# EAGLE design TouchProof_Breakout (EAGLE 9.3.2)
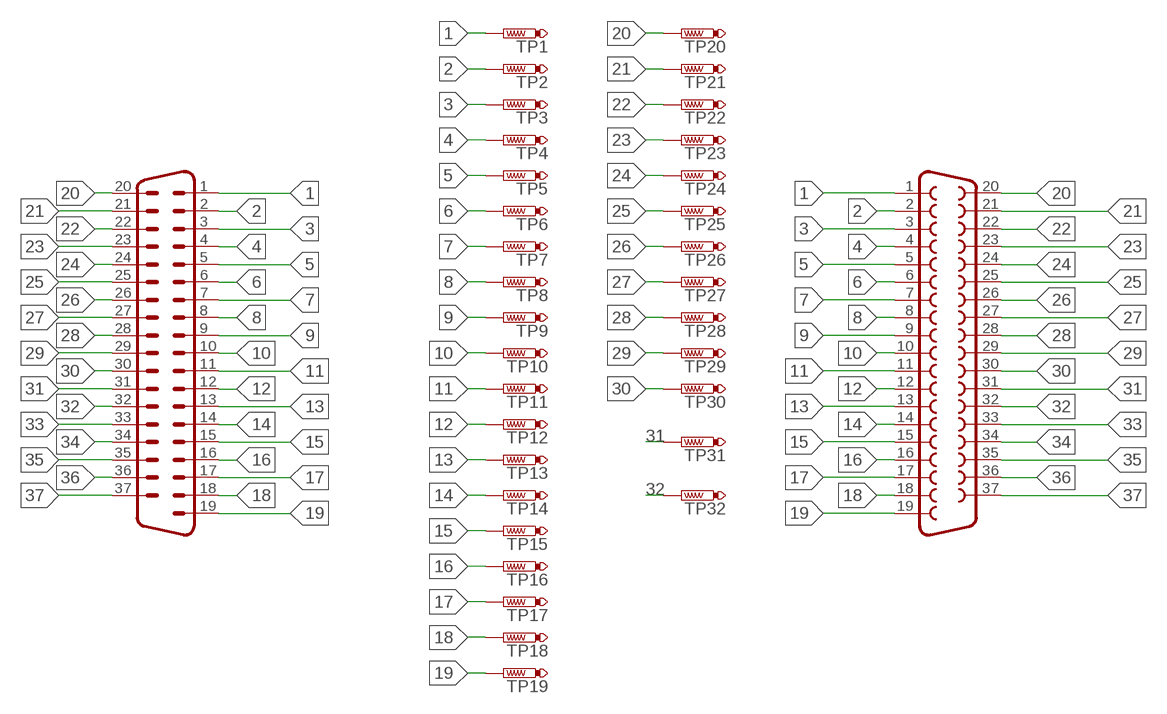
[diagram p0: schematic, sheet 1]

## Parts
TP1  TOUCHPROOF  [TOUCHPROOF_PIN]
TP2  TOUCHPROOF  [TOUCHPROOF_PIN]
TP3  TOUCHPROOF  [TOUCHPROOF_PIN]
TP4  TOUCHPROOF  [TOUCHPROOF_PIN]
TP5  TOUCHPROOF  [TOUCHPROOF_PIN]
TP6  TOUCHPROOF  [TOUCHPROOF_PIN]
TP7  TOUCHPROOF  [TOUCHPROOF_PIN]
TP8  TOUCHPROOF  [TOUCHPROOF_PIN]
TP9  TOUCHPROOF  [TOUCHPROOF_PIN]
TP10  TOUCHPROOF  [TOUCHPROOF_PIN]
TP11  TOUCHPROOF  [TOUCHPROOF_PIN]
TP12  TOUCHPROOF  [TOUCHPROOF_PIN]
TP13  TOUCHPROOF  [TOUCHPROOF_PIN]
TP14  TOUCHPROOF  [TOUCHPROOF_PIN]
TP15  TOUCHPROOF  [TOUCHPROOF_PIN]
TP16  TOUCHPROOF  [TOUCHPROOF_PIN]
TP17  TOUCHPROOF  [TOUCHPROOF_PIN]
TP18  TOUCHPROOF  [TOUCHPROOF_PIN]
TP19  TOUCHPROOF  [TOUCHPROOF_PIN]
TP20  TOUCHPROOF  [TOUCHPROOF_PIN]
TP21  TOUCHPROOF  [TOUCHPROOF_PIN]
TP22  TOUCHPROOF  [TOUCHPROOF_PIN]
TP23  TOUCHPROOF  [TOUCHPROOF_PIN]
TP24  TOUCHPROOF  [TOUCHPROOF_PIN]
TP25  TOUCHPROOF  [TOUCHPROOF_PIN]
TP26  TOUCHPROOF  [TOUCHPROOF_PIN]
TP27  TOUCHPROOF  [TOUCHPROOF_PIN]
TP28  TOUCHPROOF  [TOUCHPROOF_PIN]
TP29  TOUCHPROOF  [TOUCHPROOF_PIN]
TP30  TOUCHPROOF  [TOUCHPROOF_PIN]
TP31  TOUCHPROOF  [TOUCHPROOF_PIN]
TP32  TOUCHPROOF  [TOUCHPROOF_PIN]
X40  M37HP  [M37HP]
X41  F37HP  [F37HP]

## Nets
1: TP1.TP X40.1 X41.1
2: TP2.TP X40.2 X41.2
3: TP3.TP X40.3 X41.3
4: TP4.TP X40.4 X41.4
5: TP5.TP X40.5 X41.5
6: TP6.TP X40.6 X41.6
7: TP7.TP X40.7 X41.7
8: TP8.TP X40.8 X41.8
9: TP9.TP X40.9 X41.9
10: TP10.TP X40.10 X41.10
11: TP11.TP X40.11 X41.11
12: TP12.TP X40.12 X41.12
13: TP13.TP X40.13 X41.13
14: TP14.TP X40.14 X41.14
15: TP15.TP X40.15 X41.15
16: TP16.TP X40.16 X41.16
17: TP17.TP X40.17 X41.17
18: TP18.TP X40.18 X41.18
19: TP19.TP X40.19 X41.19
20: TP20.TP X40.20 X41.20
21: TP21.TP X40.21 X41.21
22: TP22.TP X40.22 X41.22
23: TP23.TP X40.23 X41.23
24: TP24.TP X40.24 X41.24
25: TP25.TP X40.25 X41.25
26: TP26.TP X40.26 X41.26
27: TP27.TP X40.27 X41.27
28: TP28.TP X40.28 X41.28
29: TP29.TP X40.29 X41.29
30: TP30.TP X40.30 X41.30
31: TP31.TP X40.31 X41.31
32: TP32.TP X40.32 X41.32
33: X40.33 X41.33
34: X40.34 X41.34
35: X40.35 X41.35
36: X40.36 X41.36
37: X40.37 X41.37

## Library data of the parts
TP1-TP32 = connector_board_lib:TOUCHPROOF: Description Big hole for touch proof pins
X40 = con-subd:M37: SUB-D; OC_FARNELL: unknown; OC_NEWARK: unknown
X41 = con-subd:F37: SUB-D; OC_FARNELL: unknown; OC_NEWARK: unknown

## Board
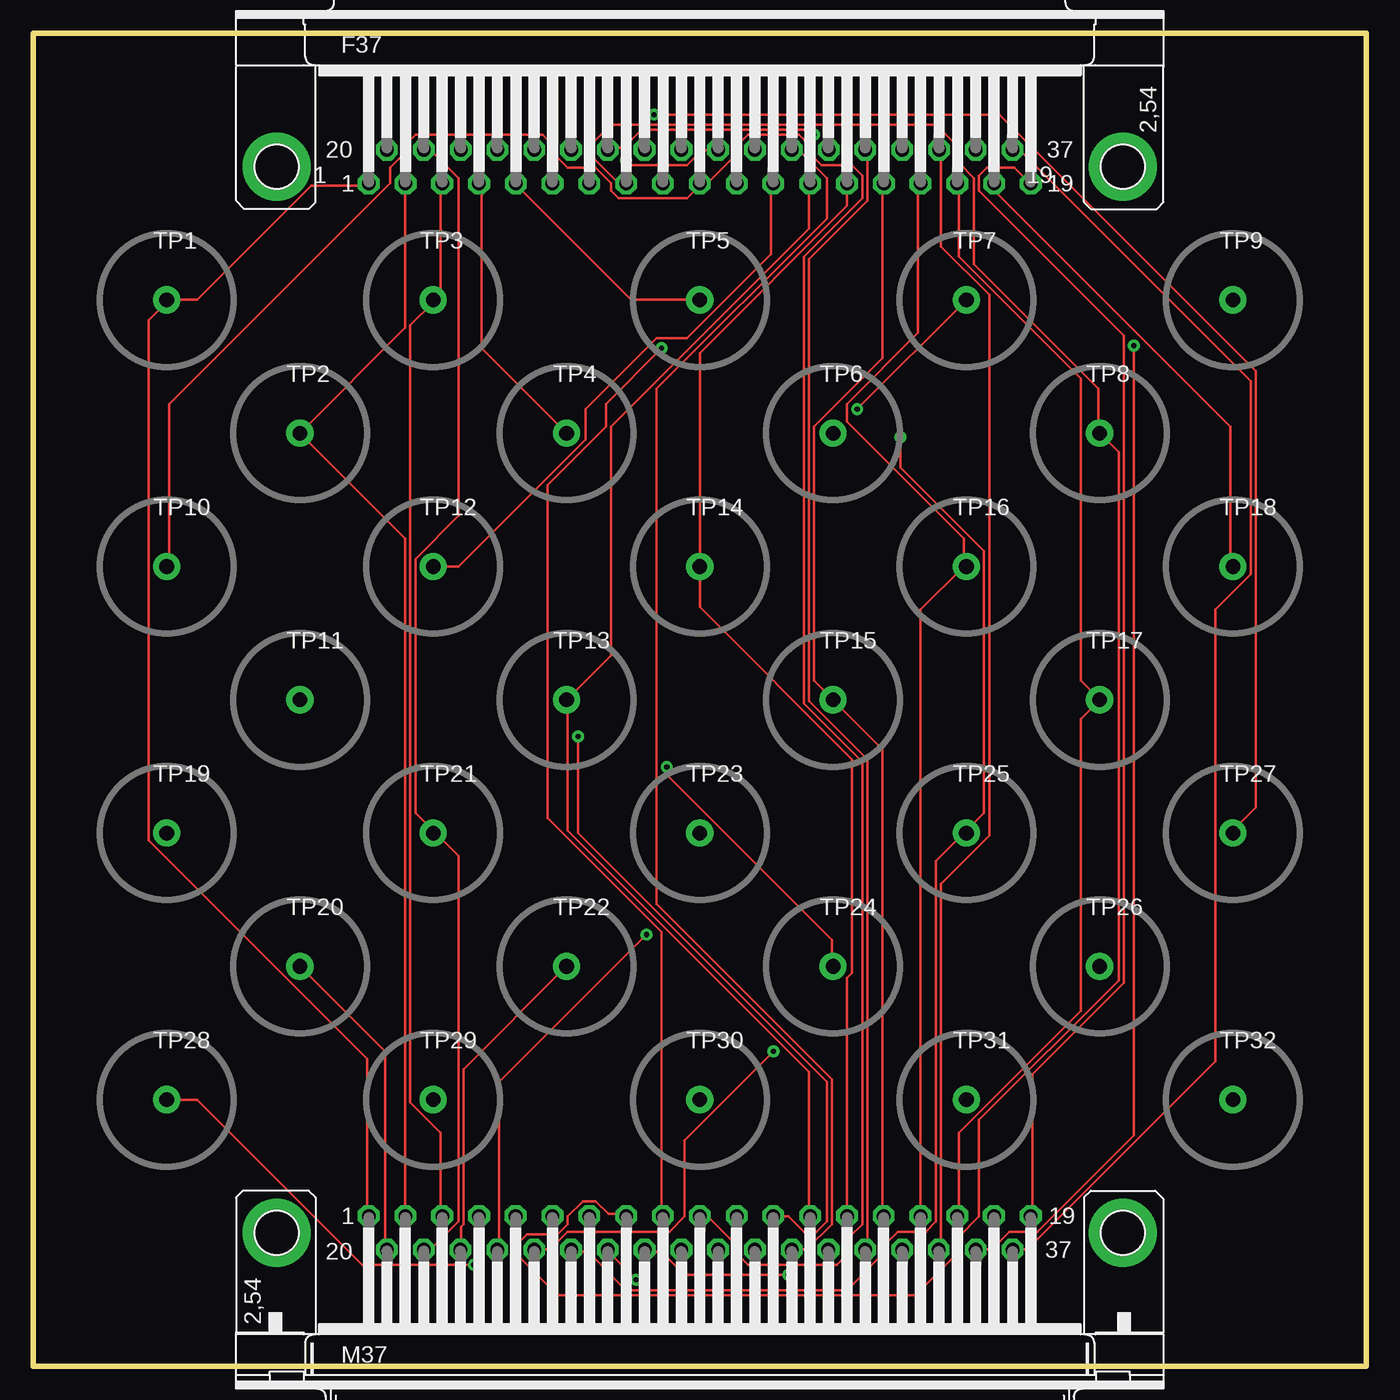
[diagram p1: board, top side]
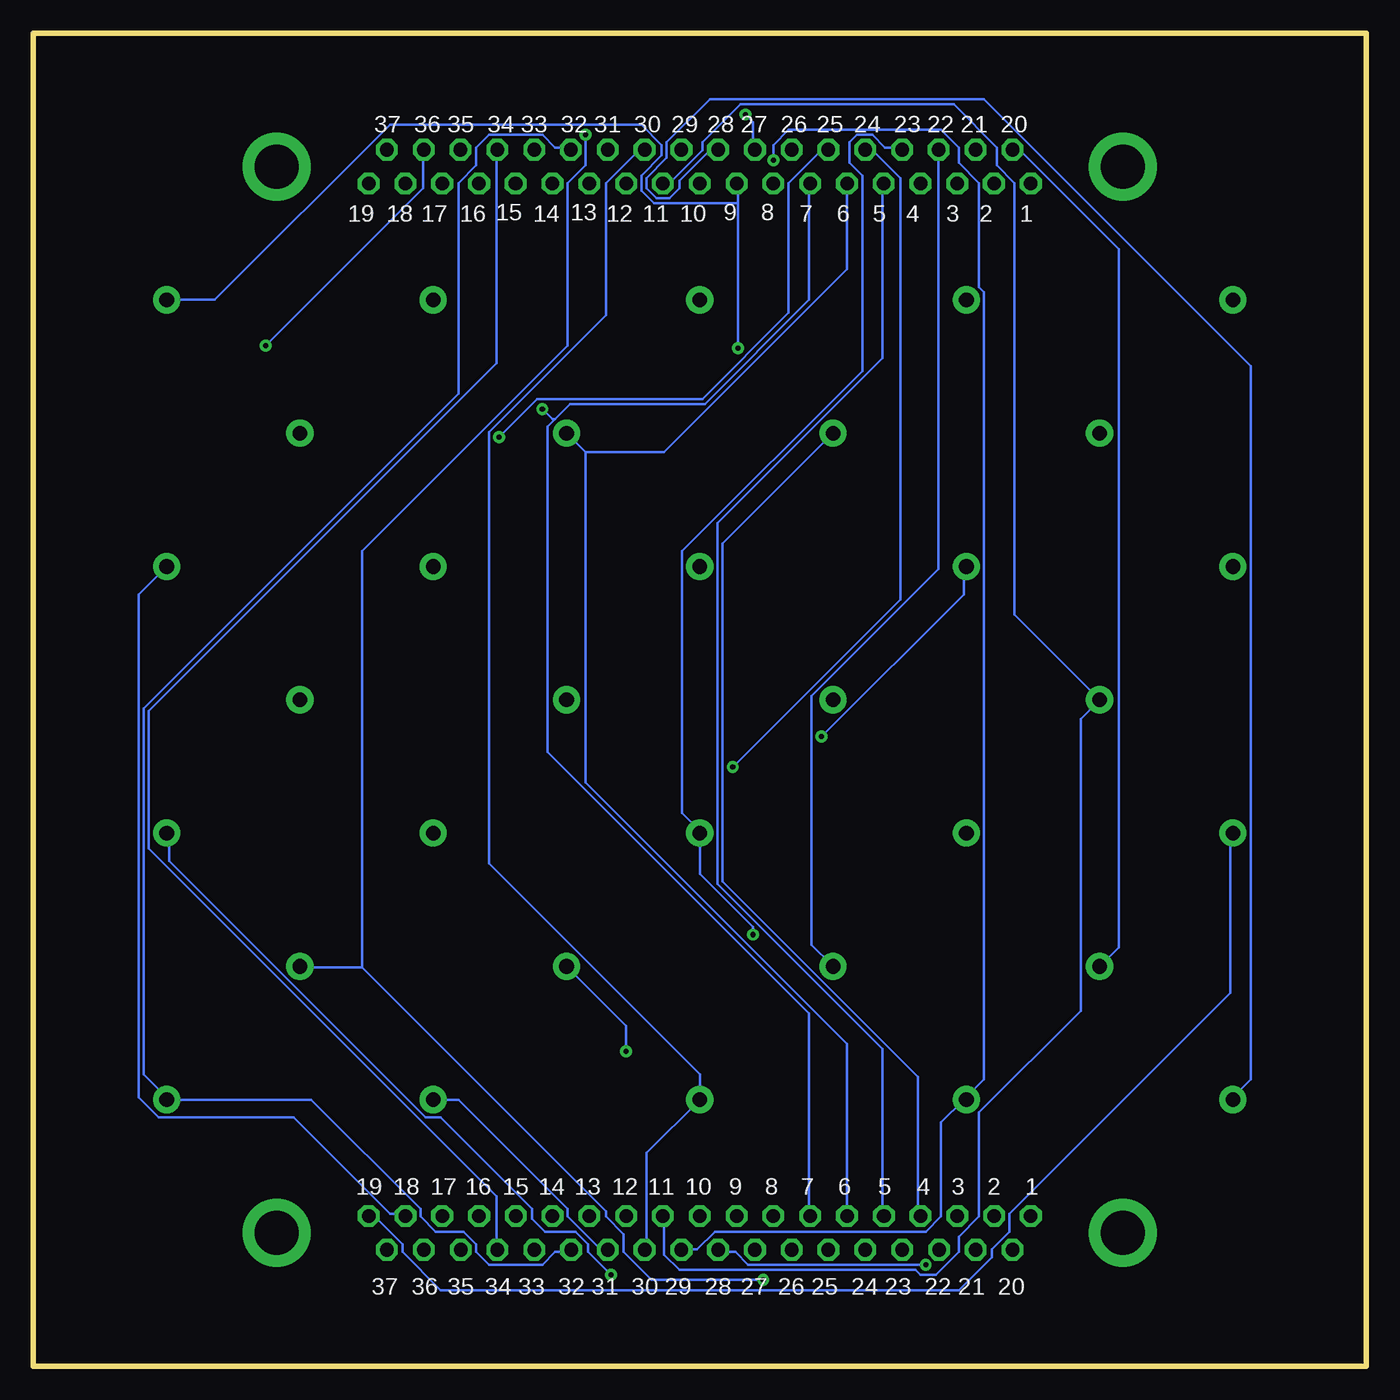
[diagram p2: board, bottom side, seen from below]

Size 100 x 100 mm. Coordinates in mm from the lower left corner, seen from the top.
Outline: 100,0 0,0 0,100 100,100 100,0
Copper layers (1*16): Top 0.035mm / dielectric 1.5mm / Bottom 0.035mm
Design rules "SparkFun-2-layer": minimum track width 7mil, minimum drill 15mil, track to track 8mil, track to pad 8mil, pad to pad 8mil, via to via 8mil, smd to smd 8mil, copper to edge 8mil, drill to drill 8mil, minimum pad ring 12mil, minimum via ring 10mil, stop-mask expansion 4mil, vias tented up to drill 20mil, thermal gap 10mil

### Footprints (pad centres in the part's own frame; a part is rotated, then mirrored left to right if it is on the bottom)
TOUCHPROOF_PIN = drill 1.1 pad 2.032: TP 0,0
M37HP = drill 1.016 octagon: 1 -24.841,1.27; 2 -22.098,1.27; 3 -19.329,1.27; 4 -16.561,1.27; 5 -13.818,1.27; 6 -11.049,1.27; 7 -8.28,1.27; 8 -5.512,1.27; 9 -2.769,1.27; 10 0,1.27; 11 2.769,1.27; 12 5.512,1.27; 13 8.28,1.27; 14 11.049,1.27; 15 13.792,1.27; 16 16.561,1.27; 17 19.329,1.27; 18 22.073,1.27; 19 24.841,1.27; 20 -23.47,-1.27; 21 -20.701,-1.27; 22 -17.958,-1.27; 23 -15.189,-1.27; 24 -12.421,-1.27; 25 -9.652,-1.27; 26 -6.909,-1.27; 27 -4.14,-1.27; 28 -1.372,-1.27; 29 1.372,-1.27; 30 4.14,-1.27; 31 6.909,-1.27; 32 9.652,-1.27; 33 12.421,-1.27; 34 15.189,-1.27; 35 17.932,-1.27; 36 20.701,-1.27; 37 23.47,-1.27 | drill 3.302 pad 5.08: G1 -31.75,0; G2 31.75,0
F37HP = drill 1.016 octagon: 1 -24.841,-1.27; 2 -22.073,-1.27; 3 -19.329,-1.27; 4 -16.561,-1.27; 5 -13.792,-1.27; 6 -11.049,-1.27; 7 -8.28,-1.27; 8 -5.512,-1.27; 9 -2.769,-1.27; 10 0,-1.27; 11 2.769,-1.27; 12 5.512,-1.27; 13 8.28,-1.27; 14 11.049,-1.27; 15 13.818,-1.27; 16 16.561,-1.27; 17 19.329,-1.27; 18 22.098,-1.27; 19 24.841,-1.27; 20 -23.47,1.27; 21 -20.701,1.27; 22 -17.932,1.27; 23 -15.189,1.27; 24 -12.421,1.27; 25 -9.652,1.27; 26 -6.909,1.27; 27 -4.14,1.27; 28 -1.372,1.27; 29 1.372,1.27; 30 4.14,1.27; 31 6.909,1.27; 32 9.677,1.27; 33 12.421,1.27; 34 15.189,1.27; 35 17.958,1.27; 36 20.701,1.27; 37 23.47,1.27 | drill 3.302 pad 5.08: G1 -31.75,0; G2 31.75,0

### Placement (x,y rotation side)
TP1  10,80 0 top
TP2  20,70 0 top
TP3  30,80 0 top
TP4  40,70 0 top
TP5  50,80 0 top
TP6  60,70 0 top
TP7  70,80 0 top
TP8  80,70 0 top
TP9  90,80 0 top
TP10  10,60 0 top
TP11  20,50 0 top
TP12  30,60 0 top
TP13  40,50 0 top
TP14  50,60 0 top
TP15  60,50 0 top
TP16  70,60 0 top
TP17  80,50 0 top
TP18  90,60 0 top
TP19  10,40 0 top
TP20  20,30 0 top
TP21  30,40 0 top
TP22  40,30 0 top
TP23  50,40 0 top
TP24  60,30 0 top
TP25  70,40 0 top
TP26  80,30 0 top
TP27  90,40 0 top
TP28  10,20 0 top
TP29  30,20 0 top
TP30  50,20 0 top
TP31  70,20 0 top
TP32  90,20 0 top
X40  50,10 0 top
X41  50,90 0 top

### Tracks (layer width: path | path; a pad name or v marks a point on that pad's centre or on a via)
1
  Top 0.178: X40.1 25.04,11.42 25.04,23.04 8.66,39.43 8.66,78.48 9.99,79.81 TP1.TP 10.19,80 12.28,80 20.85,88.58 25.04,88.58 X41.1
2
  Top 0.178: X40.2 27.9,62.09 20.09,69.91 TP2.TP 20.09,70.1 27.9,77.91 27.9,88.58 X41.2
3
  Top 0.178: X40.3 30.57,11.42 30.57,17.52 28.28,19.8 28.28,78.1 30,79.81 TP3.TP 30.19,80 30.57,80.38 30.57,88.58 X41.3
4
  Top 0.178: TP4.TP 33.62,76.38 33.62,88.58 X41.4
  Bottom 0.178: TP4.TP 48.29,61.71 48.29,36.38 33.62,21.71 33.62,11.42 X40.4
5
  Top 0.178: TP5.TP 44.86,80 36.28,88.58 X41.5
  Bottom 0.178: X40.5 36.28,11.42 36.28,23.8 48.67,36.19 48.67,63.24 36.28,75.62 36.28,88.58 X41.5
6
  Bottom 0.178: X40.6 38.95,24.19 58.57,43.81 58.57,68.57 | TP6.TP 58.57,68.57 | X41.6 38.95,82.29 52.67,68.57 58.57,68.57
7  (via drill 0.38)
  Top 0.178: v61.81,71.81 TP7.TP
  Bottom 0.178: 60.86,71.05 59.72,72.19 49.62,72.19 41.81,80 41.81,88.58 X41.7 | 60.86,71.05 61.43,70.48 61.43,46.09 41.81,26.47 41.81,11.42 X40.7 | v61.81,71.81 61.05,71.05 60.86,71.05
8
  Top 0.178: X40.8 44.48,11.42 43.14,11.42 42.19,12.38 41.24,12.38 40.09,11.23 40.09,10.66 39.33,9.9 37.05,9.9 36.48,9.33 36.48,8.18 39.33,5.33 66.19,5.33 69.43,8.56 69.43,9.71 70.95,11.23 70.95,18.47 81.43,28.95 81.43,68.57 80.1,69.91 TP8.TP 79.91,70.1 79.91,73.34 70.57,82.67 70.57,89.15 69.43,90.29 69.43,91.43 67.72,93.15 43.33,93.15 41.81,91.62 41.81,90.86 43.9,88.77 44.48,88.77 X41.8
9  (via drill 0.38)
  Top 0.178: v47.14,76.38 42.95,72.19 42.95,70.48 38.57,66.1 38.57,41.14 47.14,32.57 47.14,11.42 X40.9
  Bottom 0.178: 47.14,87.24 47.14,88.58 X41.9 | 47.14,87.24 v47.14,76.38 | 47.14,87.24 53.43,87.24 54.38,88.19 54.38,89.34 52.86,90.86 52.86,91.62 54.38,93.15 73.24,93.15 86.39,80 89.81,80 TP9.TP
10
  Top 0.178: X40.10 50,11.23 50.57,11.23 52.86,8.95 52.86,8.37 53.62,7.61 60.29,7.61 61.24,8.56 61.24,9.71 62.19,10.66 62.19,45.33 57.81,49.71 57.81,83.24 62.19,87.62 62.19,89.34 61.43,90.1 59.14,90.1 58.19,91.05 58.19,91.62 57.43,92.38 53.62,92.38 52.48,91.24 52.48,90.67 50.57,88.77 50,88.77 X41.10 50,88.58 49.05,87.62 43.9,87.62 43.33,88.19 43.33,88.77 42.19,89.91 40.09,89.91 39.14,90.86 39.14,91.43 38.19,92.38 28.66,92.38 28.09,91.81 28.09,91.24 26.76,89.91 26.76,88.77 10.19,72.19 10.19,60 TP10.TP
11
  Bottom 0.178: X40.11 52.67,11.23 52.67,8.37 51.52,7.23 33.81,7.23 33.43,6.85 32.28,6.85 30.57,8.56 30.57,9.71 29.05,11.23 29.05,19.04 21.43,26.66 21.43,48.57 20.09,49.9 TP11.TP 20.09,50.09 26.38,56.38 26.38,88.77 27.71,90.1 27.71,91.43 30.95,94.67 46.95,94.67 49.81,91.81 49.81,91.24 52.29,88.77 52.67,88.77 X41.11
12  (via drill 0.38)
  Top 0.178: v40.86,47.24 40.86,40 59.52,21.33 59.52,10.85 58.76,10.09 57.81,10.09 56.67,11.23 55.52,11.23 X40.12 | TP12.TP 31.9,60 41.43,69.53 41.43,71.81 46.76,77.14 49.05,77.14 55.33,83.43 55.33,88.58 X41.12
  Bottom 0.178: v40.86,47.24 30.19,57.91 30.19,60 TP12.TP
13
  Top 0.178: X40.13 58.19,11.42 58.19,22.09 40.09,40.19 40.09,49.9 TP13.TP 43.33,53.33 43.33,70.48 58.19,85.34 58.19,88.58 X41.13
14
  Top 0.178: X40.14 61.05,29.14 61.43,29.52 61.43,45.52 50,56.95 TP14.TP 50,76 61.05,87.05 X41.14
15
  Top 0.178: X40.15 63.72,11.42 63.72,46.28 TP15.TP 58.57,51.43 58.57,70.48 63.72,75.62 63.72,88.58 X41.15
16
  Top 0.178: 69.81,60 66.57,56.76 66.57,11.42 X40.16 | 69.81,60 69.81,62.09 61.05,70.86 61.05,72.19 66.38,77.53 66.38,88.58 X41.16 | 69.81,60 TP16.TP
17
  Top 0.178: X40.17 69.43,11.42 69.43,17.52 78.58,26.66 78.58,48.57 79.91,49.9 TP17.TP 79.91,50.09 78.58,51.43 78.58,74.1 69.43,83.24 69.43,88.58 X41.17
18
  Top 0.178: X41.18 72.1,88.19 89.81,70.48 89.81,60 TP18.TP
  Bottom 0.178: X40.18 72.1,11.42 73.24,11.42 80.48,18.66 90.58,18.66 92.1,20.19 92.1,57.91 TP18.TP
19
  Top 0.178: X40.19 74.96,11.42 74.96,21.9 81.81,28.76 81.81,77.34 70.95,88.19 70.95,89.34 71.53,89.91 73.62,89.91 74.77,88.77 X41.19
  Bottom 0.178: TP19.TP 10.19,40 10.19,28 26.76,11.42 26.76,10.09 28.09,8.76 28.09,8.18 30.57,5.71 69.43,5.71 72.29,8.56 72.29,9.14 74.38,11.23 74.77,11.23 X40.19
20
  Top 0.178: X40.20 26.38,8.76 26.38,23.61 20.09,29.9 TP20.TP
  Bottom 0.178: X41.20 26.38,91.24 26,91.24 18.57,83.81 18.57,31.43 19.9,30.09 TP20.TP
21
  Top 0.178: X40.21 29.43,8.76 29.81,8.76 31.9,10.85 31.9,38.28 30.19,40 TP21.TP 30,40.19 28.66,41.52 28.66,60.57 31.9,63.81 31.9,89.15 29.81,91.24 29.43,91.24 X41.21
22
  Top 0.178: X40.22 32.09,8.76 32.09,10.47 32.28,10.66 32.28,22.28 39.9,29.9 TP22.TP
  Bottom 0.178: X41.22 32.09,91.24 32.09,59.81 41.62,50.28 41.62,31.62 40.09,30.09 TP22.TP
23  (via drill 0.38)
  Top 0.178: v46,32.38 34.95,21.33 34.95,8.76 X40.23
  Bottom 0.178: v46,32.38 46,32.95 50,36.95 TP23.TP 50,40.19 51.33,41.52 51.33,61.14 37.81,74.67 37.81,89.34 38.76,90.29 38.76,91.81 38.19,92.38 37.05,92.38 36.09,91.43 34.95,91.43 X41.23
24  (via drill 0.38)
  Top 0.178: v55.52,23.61 48.86,16.95 48.86,11.23 47.71,10.09 40.09,10.09 38.76,8.76 37.62,8.76 X40.24 | v47.52,44.95 47.52,44.38 59.91,32 59.91,30.09 TP24.TP
  Bottom 0.178: v55.52,23.61 55.52,25.52 59.91,29.9 TP24.TP | v47.52,44.95 34.95,57.52 34.95,89.15 37.05,91.24 37.43,91.24 X41.24
25  (via drill 0.38)
  Top 0.178: X40.25 40.48,8.56 41.62,8.56 44.48,5.71 61.05,5.71 63.91,8.56 63.91,9.14 64.86,10.09 66.95,10.09 67.72,10.85 67.72,37.9 69.81,40 TP25.TP 70,40.19 71.34,41.52 71.34,61.14 65.05,67.43 v65.05,69.72
  Bottom 0.178: v65.05,69.72 62.19,72.57 49.81,72.57 43.33,79.05 43.33,88.77 40.86,91.24 40.48,91.24 X41.25
26  (via drill 0.38)
  Top 0.178: v45.24,6.47 43.14,8.56 X40.26 | v58.57,92.38 58.19,92.77 45.62,92.77 44.28,91.43 43.14,91.43 X41.26
  Bottom 0.178: v45.24,6.47 53.62,6.47 55.72,8.56 55.72,9.9 57.05,11.23 57.05,11.61 75.34,29.9 | 75.34,29.9 79.91,29.9 TP26.TP | v58.57,92.38 58.57,90.1 59.91,88.77 59.91,76.57 75.34,61.14 75.34,29.9
27  (via drill 0.38)
  Top 0.178: v56.67,6.85 48.86,6.85 47.14,8.56 46,8.56 X40.27 | v46.57,93.91 72.48,93.91 91.72,74.67 91.72,41.9 90,40.19 TP27.TP
  Bottom 0.178: v56.67,6.85 58.38,8.56 58.38,9.14 59.34,10.09 61.62,10.09 62.57,11.04 62.57,11.8 69.43,18.66 70.57,18.66 89.81,37.9 89.81,40 TP27.TP | v46.57,93.91 46,93.34 46,91.43 X41.27
28  (via drill 0.38)
  Top 0.178: v33.05,7.61 24.66,7.61 12.28,19.99 10.19,19.99 TP28.TP
  Bottom 0.178: v33.05,7.61 46.38,7.61 47.33,8.56 48.48,8.56 X40.28 | X41.28 48.67,91.24 49.24,91.24 51.52,88.96 51.52,88.38 52.29,87.62 53.24,87.62 54,88.38 54,89.15 52.48,90.67 52.48,91.81 49.24,95.05 28.66,95.05 8.66,75.05 8.66,21.52 9.99,20.19 TP28.TP
29  (via drill 0.38)
  Top 0.178: v44.48,90.48 44.86,90.1 49.05,90.1 50.19,91.24 51.33,91.24 X41.29
  Bottom 0.178: X40.29 51.33,8.76 50.19,8.76 48.86,10.09 33.05,10.09 31.9,11.23 31.9,18.28 30.19,19.99 TP29.TP 30,20.19 28.66,21.52 28.66,80.57 29.05,80.95 29.05,88.77 30.57,90.29 30.57,91.43 31.9,92.77 43.33,92.77 44.48,91.62 v44.48,90.48
30
  Bottom 0.178: X40.30 54,8.76 54,15.99 TP30.TP 50,21.9 65.81,37.71 65.81,70.1 57.05,78.86 57.05,88.77 54.57,91.24 54.19,91.24 X41.30
31
  Top 0.178: X41.31 57.05,91.24 57.43,91.24 59.52,89.15 59.52,86.1 46.76,73.34 46.76,34.66 59.91,21.52 59.91,10.66 58,8.76 57.05,8.76 X40.31
  Bottom 0.178: X40.31 57.05,8.76 57.43,8.76 59.91,11.23 59.91,11.8 68.1,19.99 69.81,19.99 TP31.TP
32
  Bottom 0.178: X40.32 59.72,8.56 60.86,8.56 61.81,7.61 65.81,7.61 66.76,8.56 66.76,9.14 67.72,10.09 69.81,10.09 70.95,11.23 70.95,11.8 79.15,19.99 89.81,19.99 TP32.TP 90,20.19 91.72,21.9 91.72,49.33 68.1,72.95 68.1,88.77 66.76,90.1 66.76,91.43 65.81,92.38 61.81,92.38 60.86,91.43 59.72,91.43 X41.32
33
  Top 0.178: X40.33 62.57,8.76 62.57,45.52 58.19,49.9 58.19,83.05 62.57,87.43 62.57,91.24 X41.33
34
  Bottom 0.178: X40.34 65.24,8.76 65.24,12.76 91.34,38.86 91.34,49.14 65.24,75.24 65.24,91.24 X41.34
35
  Top 0.178: X40.35 68.1,8.76 68.1,36.19 71.72,39.81 71.72,80.38 68.1,84 68.1,91.24 X41.35
36  (via drill 0.38)
  Top 0.178: v82.58,76.57 82.58,17.33 75.34,10.09 73.24,10.09 71.91,8.76 70.77,8.76 X40.36
  Bottom 0.178: v82.58,76.57 70.77,88.38 70.77,91.24 X41.36
37
  Top 0.178: X40.37 73.62,8.76 74.58,8.76 88.67,22.85 88.67,56.76 91.34,59.43 91.34,73.91 74,91.24 73.62,91.24 X41.37

### Text on the board
tNames: 1 | 19 | DSUB TO PINS / V 2.0 | 1 | 19
bNames: 20 | 21 | 22 | 23 | 24 | 25 | 26 | 27 | 28 | 29 | 30 | 31 | 32 | 33 | 34 | 35 | 36 | 37 | 1 | 2 | 3 | 4 | 5 | 6 | 7 | 8 | 9 | 10 | 11 | 12 | 13 | 14 | 15 | 16 | 17 | 18 | 19 | 1 | 2 | 3 | 4 | 5 | 6 | 7 | 8 | 9 | 10 | 11 | 12 | 13 | 14 | 15 | 16 | 17 | 18 | 19 | 20 | 21 | 22 | 23 | 24 | 25 | 26 | 27 | 28 | 29 | 30 | 31 | 32 | 33 | 34 | 35 | 36 | 37
ttext: 1 | 1 | 3 | 5 | 7 | 9 | Dsub2TouchProof | 2 | 4 | 6 | 8 | 10 | 12 | 14 | 16 | 18 | 11 | 13 | 15 | 17 | 19 | 21 | 23 | 25 | 27 | 20 | 22 | 24 | 26 | 28 | 29 | 30 | 31 | 32 | 1
btext: 1 | 1 | 3 | 5 | 7 | 9 | Dsub2TouchProof | 2 | 4 | 6 | 8 | 10 | 12 | 14 | 16 | 18 | 11 | 13 | 15 | 17 | 19 | 21 | 23 | 25 | 27 | 20 | 22 | 24 | 26 | 28 | 29 | 30 | 31 | 32 | 1